# EAGLE design untitled (EAGLE 9.5.1)
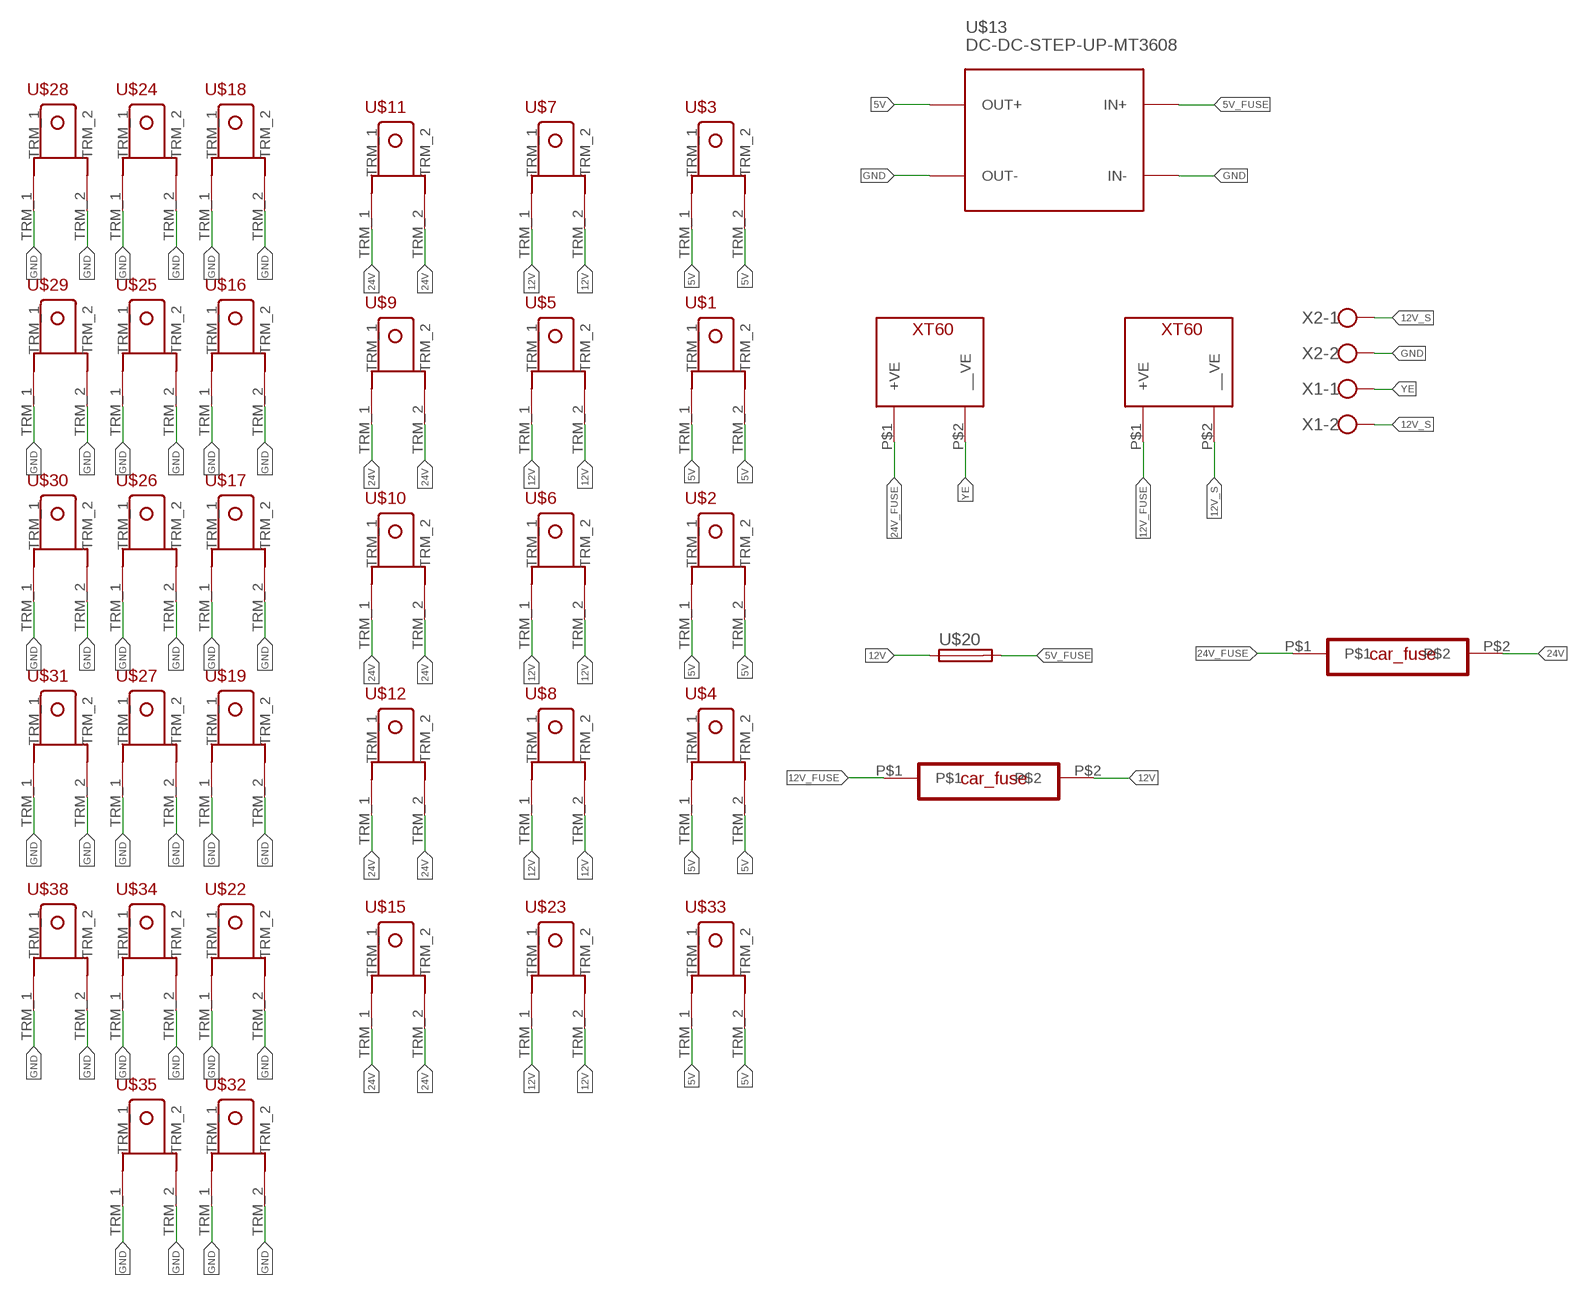
[diagram p0: schematic, sheet 1]

## Parts
U$1  TERMINAL_EDITED  [TERMINAL_EDITED]
U$2  TERMINAL_EDITED  [TERMINAL_EDITED]
U$3  TERMINAL_EDITED  [TERMINAL_EDITED]
U$4  TERMINAL_EDITED  [TERMINAL_EDITED]
U$5  TERMINAL_EDITED  [TERMINAL_EDITED]
U$6  TERMINAL_EDITED  [TERMINAL_EDITED]
U$7  TERMINAL_EDITED  [TERMINAL_EDITED]
U$8  TERMINAL_EDITED  [TERMINAL_EDITED]
U$9  TERMINAL_EDITED  [TERMINAL_EDITED]
U$10  TERMINAL_EDITED  [TERMINAL_EDITED]
U$11  TERMINAL_EDITED  [TERMINAL_EDITED]
U$12  TERMINAL_EDITED  [TERMINAL_EDITED]
U$13  DC-DC-STEP-UP-MT3608  [DC-DC-STEP-UP-MT3608]
U$14  CAR_FUSE  [CAR_FUSE]
U$15  TERMINAL_EDITED  [TERMINAL_EDITED]
U$16  TERMINAL_EDITED  [TERMINAL_EDITED]
U$17  TERMINAL_EDITED  [TERMINAL_EDITED]
U$18  TERMINAL_EDITED  [TERMINAL_EDITED]
U$19  TERMINAL_EDITED  [TERMINAL_EDITED]
U$20  FUSE_HOLDER  [SH22,5A]
U$21  CAR_FUSE  [CAR_FUSE]
U$22  TERMINAL_EDITED  [TERMINAL_EDITED]
U$23  TERMINAL_EDITED  [TERMINAL_EDITED]
U$24  TERMINAL_EDITED  [TERMINAL_EDITED]
U$25  TERMINAL_EDITED  [TERMINAL_EDITED]
U$26  TERMINAL_EDITED  [TERMINAL_EDITED]
U$27  TERMINAL_EDITED  [TERMINAL_EDITED]
U$28  TERMINAL_EDITED  [TERMINAL_EDITED]
U$29  TERMINAL_EDITED  [TERMINAL_EDITED]
U$30  TERMINAL_EDITED  [TERMINAL_EDITED]
U$31  TERMINAL_EDITED  [TERMINAL_EDITED]
U$32  TERMINAL_EDITED  [TERMINAL_EDITED]
U$33  TERMINAL_EDITED  [TERMINAL_EDITED]
U$34  TERMINAL_EDITED  [TERMINAL_EDITED]
U$35  TERMINAL_EDITED  [TERMINAL_EDITED]
U$36  XT60_CONNECTOR  [XT60]
U$37  XT60_CONNECTOR  [XT60]
U$38  TERMINAL_EDITED  [TERMINAL_EDITED]
X1  ROSTA.POWER  [W239-302]
X2  ROSTA.POWER  [W239-302]

## Nets
5V: U$1.TRM_1 U$1.TRM_2 U$2.TRM_1 U$2.TRM_2 U$3.TRM_1 U$3.TRM_2 U$4.TRM_1 U$4.TRM_2 U$13.OUT+ U$33.TRM_1 U$33.TRM_2
5V_FUSE: U$13.IN+ U$20.2
12V: U$5.TRM_1 U$5.TRM_2 U$6.TRM_1 U$6.TRM_2 U$7.TRM_1 U$7.TRM_2 U$8.TRM_1 U$8.TRM_2 U$14.P$2 U$20.1 U$23.TRM_1 U$23.TRM_2
12V_FUSE: U$14.P$1 U$37.P$1(+VE)
12V_S: U$37.P$2(__VE) X1.2 X2.1
24V: U$9.TRM_1 U$9.TRM_2 U$10.TRM_1 U$10.TRM_2 U$11.TRM_1 U$11.TRM_2 U$12.TRM_1 U$12.TRM_2 U$15.TRM_1 U$15.TRM_2 U$21.P$2
24V_FUSE: U$21.P$1 U$36.P$1(+VE)
GND: U$13.IN- U$13.OUT- U$16.TRM_1 U$16.TRM_2 U$17.TRM_1 U$17.TRM_2 U$18.TRM_1 U$18.TRM_2 U$19.TRM_1 U$19.TRM_2 U$22.TRM_1 U$22.TRM_2 U$24.TRM_1 U$24.TRM_2 U$25.TRM_1 U$25.TRM_2 U$26.TRM_1 U$26.TRM_2 U$27.TRM_1 U$27.TRM_2 U$28.TRM_1 U$28.TRM_2 U$29.TRM_1 U$29.TRM_2 U$30.TRM_1 U$30.TRM_2 U$31.TRM_1 U$31.TRM_2 U$32.TRM_1 U$32.TRM_2 U$34.TRM_1 U$34.TRM_2 U$35.TRM_1 U$35.TRM_2 U$38.TRM_1 U$38.TRM_2 X2.2
YE: U$36.P$2(__VE) X1.1

## Library data of the parts
U$1-U$12 U$15-U$19 U$22-U$35 U$38 = MIA_LIBRARY-2-2-2:TERMINAL_EDITED
U$13 = MIA_LIBRARY-2-2-2:DC-DC-STEP-UP-MT3608: DC/DC Step-Up Regulator based on MT3608 chip MT3608 datasheet available here: https://www.olimex.com/Products/Breadboarding/BB-PWR-3608/resources/MT3608.pdf Click here to find device on ebay.com <http://www.ebay.com/sch/mt3608+module>
U$14 U$21 = MIA_LIBRARY-2-2-2:CAR_FUSE
U$20 = MIA_LIBRARY-2-2-2:FUSE_HOLDER
U$36 U$37 = MIA_LIBRARY-2-2-2:XT60_CONNECTOR
X1 X2 = MIA_LIBRARY-2-2-2:ROSTA.POWER: WAGO SCREW CLAMP; OC_FARNELL: unknown; OC_NEWARK: unknown

## Board
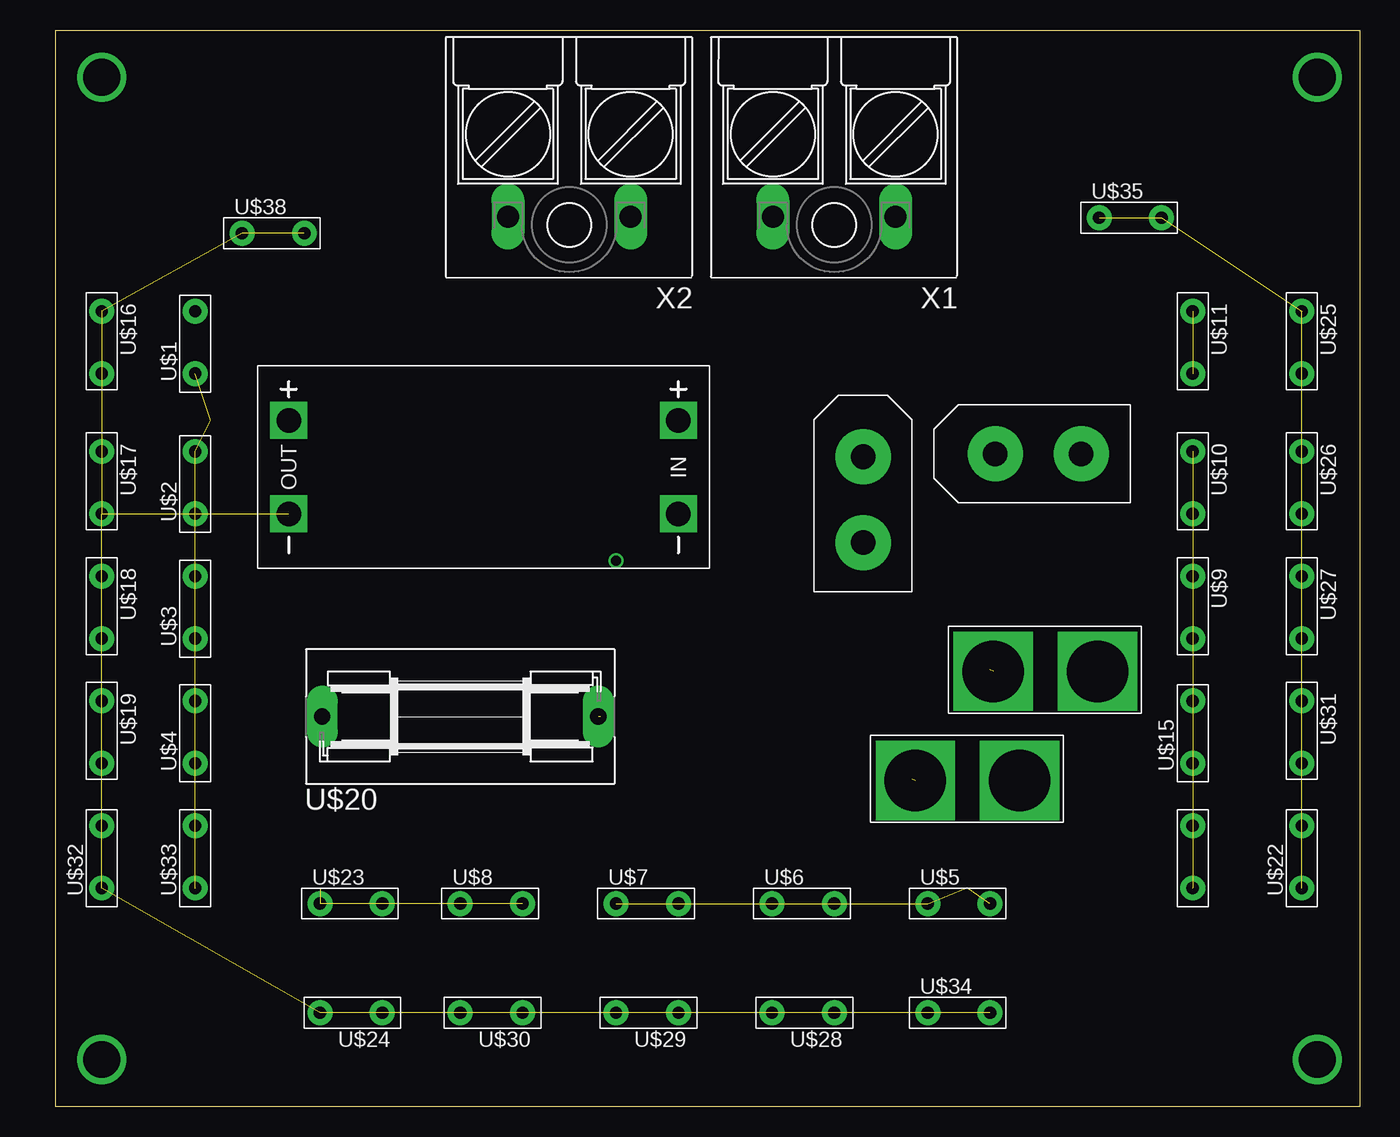
[diagram p1: board, top side]
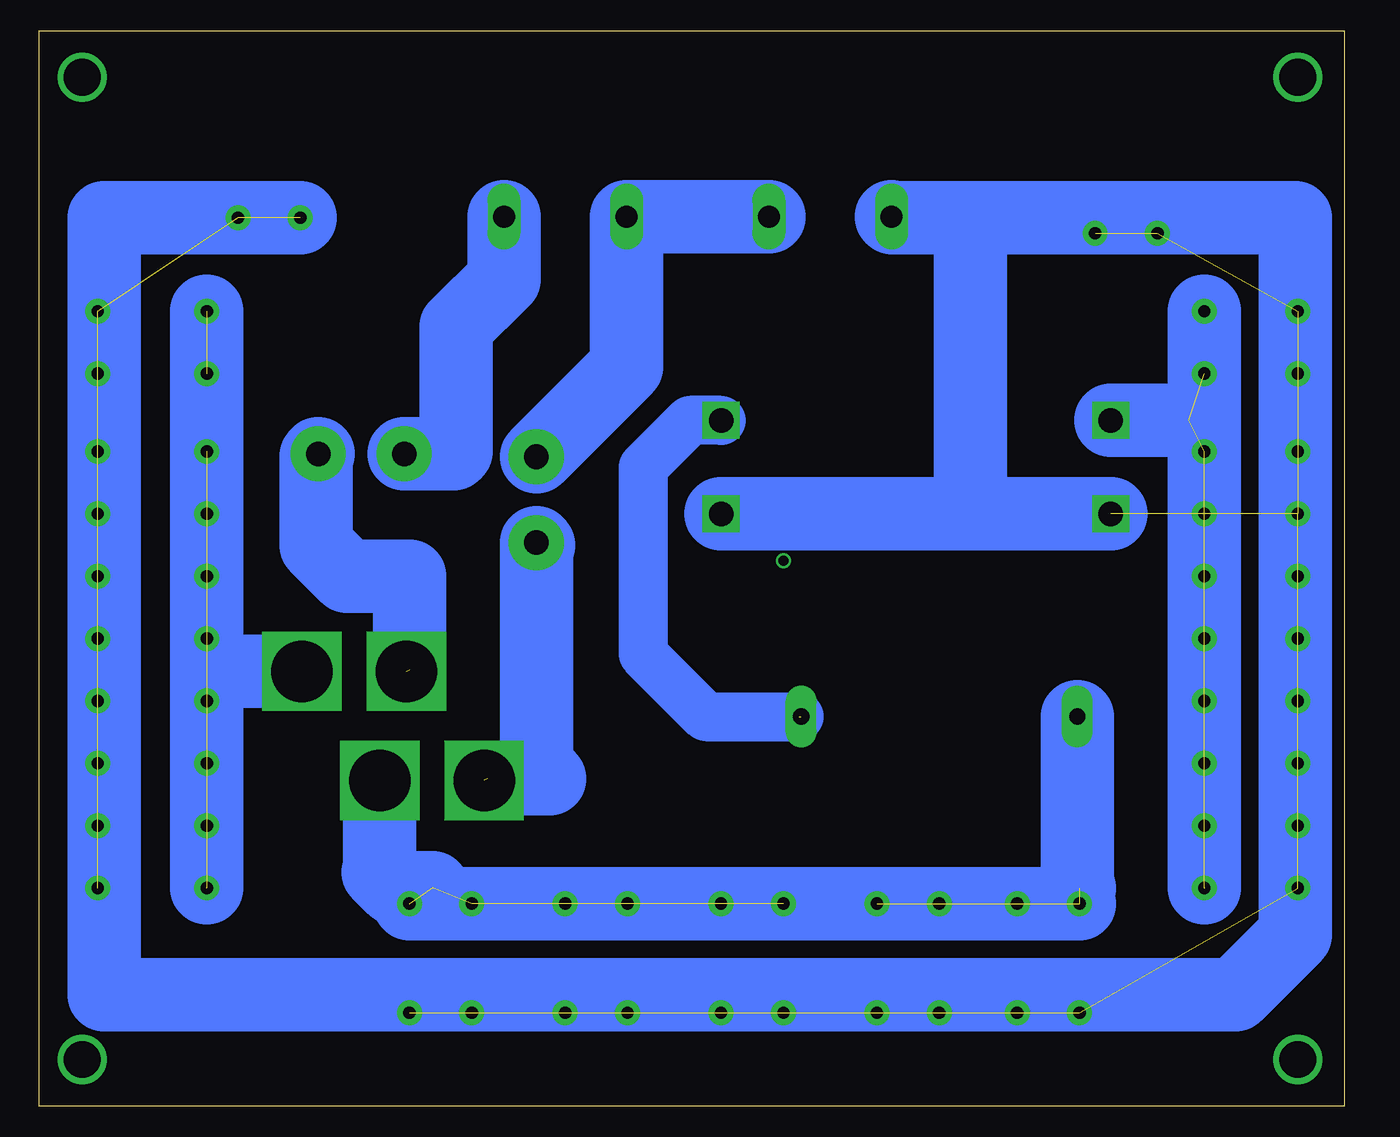
[diagram p2: board, bottom side, seen from below]

Size 106.35 x 87.62 mm. Coordinates in mm from the lower left corner, seen from the top.
Outline: 0,0 106.35,0 106.35,87.62 0,87.62 0,0
Copper layers (1*16): Top 0.035mm / dielectric 1.5mm / Bottom 0.035mm
Design rules "default": minimum track width 6mil, minimum drill 0.35mm, track to track 6mil, track to pad 6mil, pad to pad 6mil, via to via 6mil, smd to smd 6mil, copper to edge 40mil, drill to drill 6mil, minimum pad ring 10mil, minimum via ring 8mil, stop-mask expansion 4mil, vias tented up to drill 0mil, thermal gap 10mil

### Footprints (pad centres in the part's own frame; a part is rotated, then mirrored left to right if it is on the bottom)
TERMINAL_EDITED = drill 1 pad 2.032: TRM_1 -2.54,0; TRM_2 2.54,0
DC-DC-STEP-UP-MT3608 = drill 2 pad 2.8 square: IN+ 15.24,3.81; IN- 15.24,-3.81; OUT+ -16.51,3.81; OUT- -16.51,-3.81
CAR_FUSE = drill 5 pad 6.452 square: P$1 2.794,-0.127; P$2 11.303,-0.127
SH22,5A = drill 1.321 pad 2.54 long: 1 -11.252,0; 2 11.252,0
XT60 = drill 2 pad 4.5: P$1 -4,-4; P$2 -11,-4
W239-302 = drill 1.8 long: 1 -5,5; 2 5,5

### Placement (x,y rotation side)
U$1  11.43,62.23 90 top
U$2  11.43,50.8 90 top
U$3  11.43,40.64 90 top
U$4  11.43,30.48 90 top
U$5  73.66,16.51 0 top
U$6  60.96,16.51 0 top
U$7  48.26,16.51 0 top
U$8  35.56,16.51 0 top
U$9  92.71,40.64 270 top
U$10  92.71,50.8 270 top
U$11  92.71,62.23 270 top
U$12  92.71,20.32 90 top
U$13  35.56,52.07 0 top
U$14  67.31,26.67 0 top
U$15  92.71,30.48 90 top
U$16  3.81,62.23 270 top
U$17  3.81,50.8 270 top
U$18  3.81,40.64 270 top
U$19  3.81,30.48 270 top
U$20  33.02,31.75 0 top
U$21  73.66,35.56 0 top
U$22  101.6,20.32 90 top
U$23  24.13,16.51 0 top
U$24  24.13,7.62 180 top
U$25  101.6,62.23 270 top
U$26  101.6,50.8 270 top
U$27  101.6,40.64 270 top
U$28  60.96,7.62 180 top
U$29  48.26,7.62 180 top
U$30  35.56,7.62 180 top
U$31  101.6,30.48 270 top
U$32  3.81,20.32 90 top
U$33  11.43,20.32 90 top
U$34  73.66,7.62 0 top
U$35  87.63,72.39 0 top
U$36  87.63,57.15 0 top
U$37  69.85,41.91 270 top
U$38  17.78,71.12 0 top
X1  63.5,77.47 180 top
X2  41.91,77.47 180 top

### Tracks (layer width: path | path; a pad name or v marks a point on that pad's centre or on a via)
5V  (10 unrouted)
  Bottom 6: U$1.TRM_2 U$33.TRM_1 | U$13.OUT+ 12.7,55.88
5V_FUSE  (1 unrouted)
  Bottom 4: U$13.IN+ 53.34,55.88 57.15,52.07 57.15,36.83 52.07,31.75 44.45,31.75
12V  (10 unrouted)
  Bottom 6: U$23.TRM_1 U$5.TRM_2 | U$14.P$2 78.61,19.18 78.74,19.05 77.48,17.79 74.3,17.79 | U$20.1 21.77,17.96 21.59,17.78
12V_FUSE  (1 unrouted)
  Bottom 6: 65.66,45.72 U$37.P$1 65.85,27.75 64.77,26.67 69.85,26.67
12V_S
  Bottom 6: X2.1 X1.2 58.5,60.26 U$37.P$2
24V  (9 unrouted)
  Bottom 6: U$11.TRM_1 92.71,35.56 | 92.71,35.56 U$12.TRM_1 | U$21.P$2 92.58,35.43 92.71,35.56
24V_FUSE  (1 unrouted)
  Bottom 6: U$36.P$1 83.82,52.96 83.82,45.72 81.28,43.18 76.2,43.18 76.2,35.56
GND  (33 unrouted)
  Bottom 6: X2.2 36.83,72.39 30.48,72.39 | 30.48,72.39 4.02,72.39 4.02,13.97 8.89,9.1 101.06,9.1 101.06,72.39 U$35.TRM_1 | U$13.OUT- 30.48,48.26 | 30.48,48.26 U$13.IN- | 30.48,48.26 30.48,72.39
N$1  (via drill 0.8)
  other vias: 45.72,44.45
N$2  (via drill 3)
  other vias: 3.81,3.81
N$3  (via drill 3)
  other vias: 102.87,3.81
N$4  (via drill 3)
  other vias: 3.81,83.82
N$5  (via drill 3)
  other vias: 102.87,83.82
YE
  Bottom 6: U$36.P$2 72.58,53.15 72.39,53.34 72.39,63.5 68.5,67.39 X1.1